# EAGLE schematic Motor (EAGLE 9.6.2)
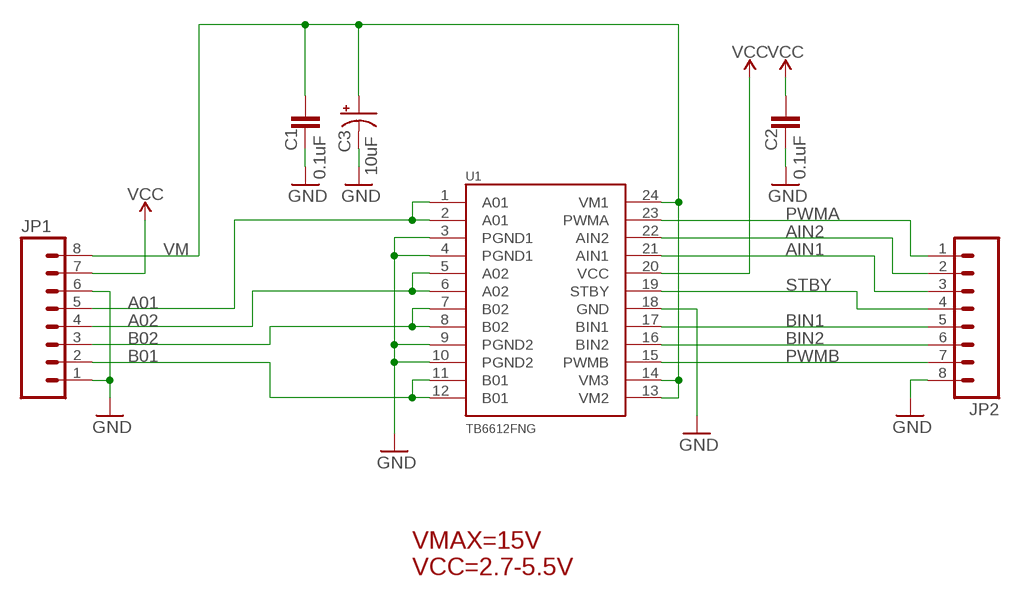
[diagram p0: schematic, sheet 1]

## Parts
C1  0.1uF  0.1UF-0402-16V-10%  [0402]
C2  0.1uF  0.1UF-0402-16V-10%  [0402]
C3  10uF  10UF-POLAR-EIA3528-20V-10%(TANT)  [EIA3528]
JP1  M0875_PERCENT_REDUCED  [1X08_OFFSET_REDUCED]
JP2  M0875_PERCENT_REDUCED  [1X08_OFFSET_REDUCED]
U1  TB6612FNG  [SSOP24]

## Nets
A01: JP1.5 U1.1(A01) U1.2(A01)
A02: JP1.4 U1.5(A02) U1.6(A02)
AIN1: JP2.3 U1.21(AIN1)
AIN2: JP2.2 U1.22(AIN2)
B01: JP1.2 U1.11(B01) U1.12(B01)
B02: JP1.3 U1.7(B02) U1.8(B02)
BIN1: JP2.5 U1.17(BIN1)
BIN2: JP2.6 U1.16(BIN2)
GND: C1.2 C2.2 C3.C(-) JP1.1 JP1.6 JP2.8 U1.3(PGND1) U1.4(PGND1) U1.9(PGND2) U1.10(PGND2) U1.18(GND)
PWMA: JP2.1 U1.23(PWMA)
PWMB: JP2.7 U1.15(PWMB)
STBY: JP2.4 U1.19(STBY)
VCC: C2.1 JP1.7 U1.20(VCC)
VM: C1.1 C3.A(+) JP1.8 U1.13(VM2) U1.14(VM3) U1.24(VM1)

## Notes on the sheet
- VMAX=15V
  VCC=2.7-5.5V

## Library data of the parts
C1 C2 = SparkFun-Capacitors:0.1UF: 0.1µF ceramic capacitors A capacitor is a passive two-terminal electrical component used to store electrical energy temporarily in an electric field.; PROD_ID: CAP-12416
C3 = SparkFun-Capacitors:10UF-POLAR: 10.0µF polarized capacitors A capacitor is a passive two-terminal electrical component used to store electrical energy temporarily in an electric field.; PROD_ID: CAP-08063
JP1 JP2 = Testing:M08: Header 8 Standard 8-pin 0.1" header. Use with straight break away headers (SKU : PRT-00116), right angle break away headers (PRT-00553), swiss pins (PRT-00743), machine pins (PRT-00117), and female headers (PRT-00115).
U1 = SparkFun-IC-Special-Function:TB6612FNG: Toshiba 1A dual motor driver IC-09363; PROD_ID: IC-09363